# EAGLE design ZS6TVB Arduino AX.25 Interface REV 1.0 (EAGLE 6.4)
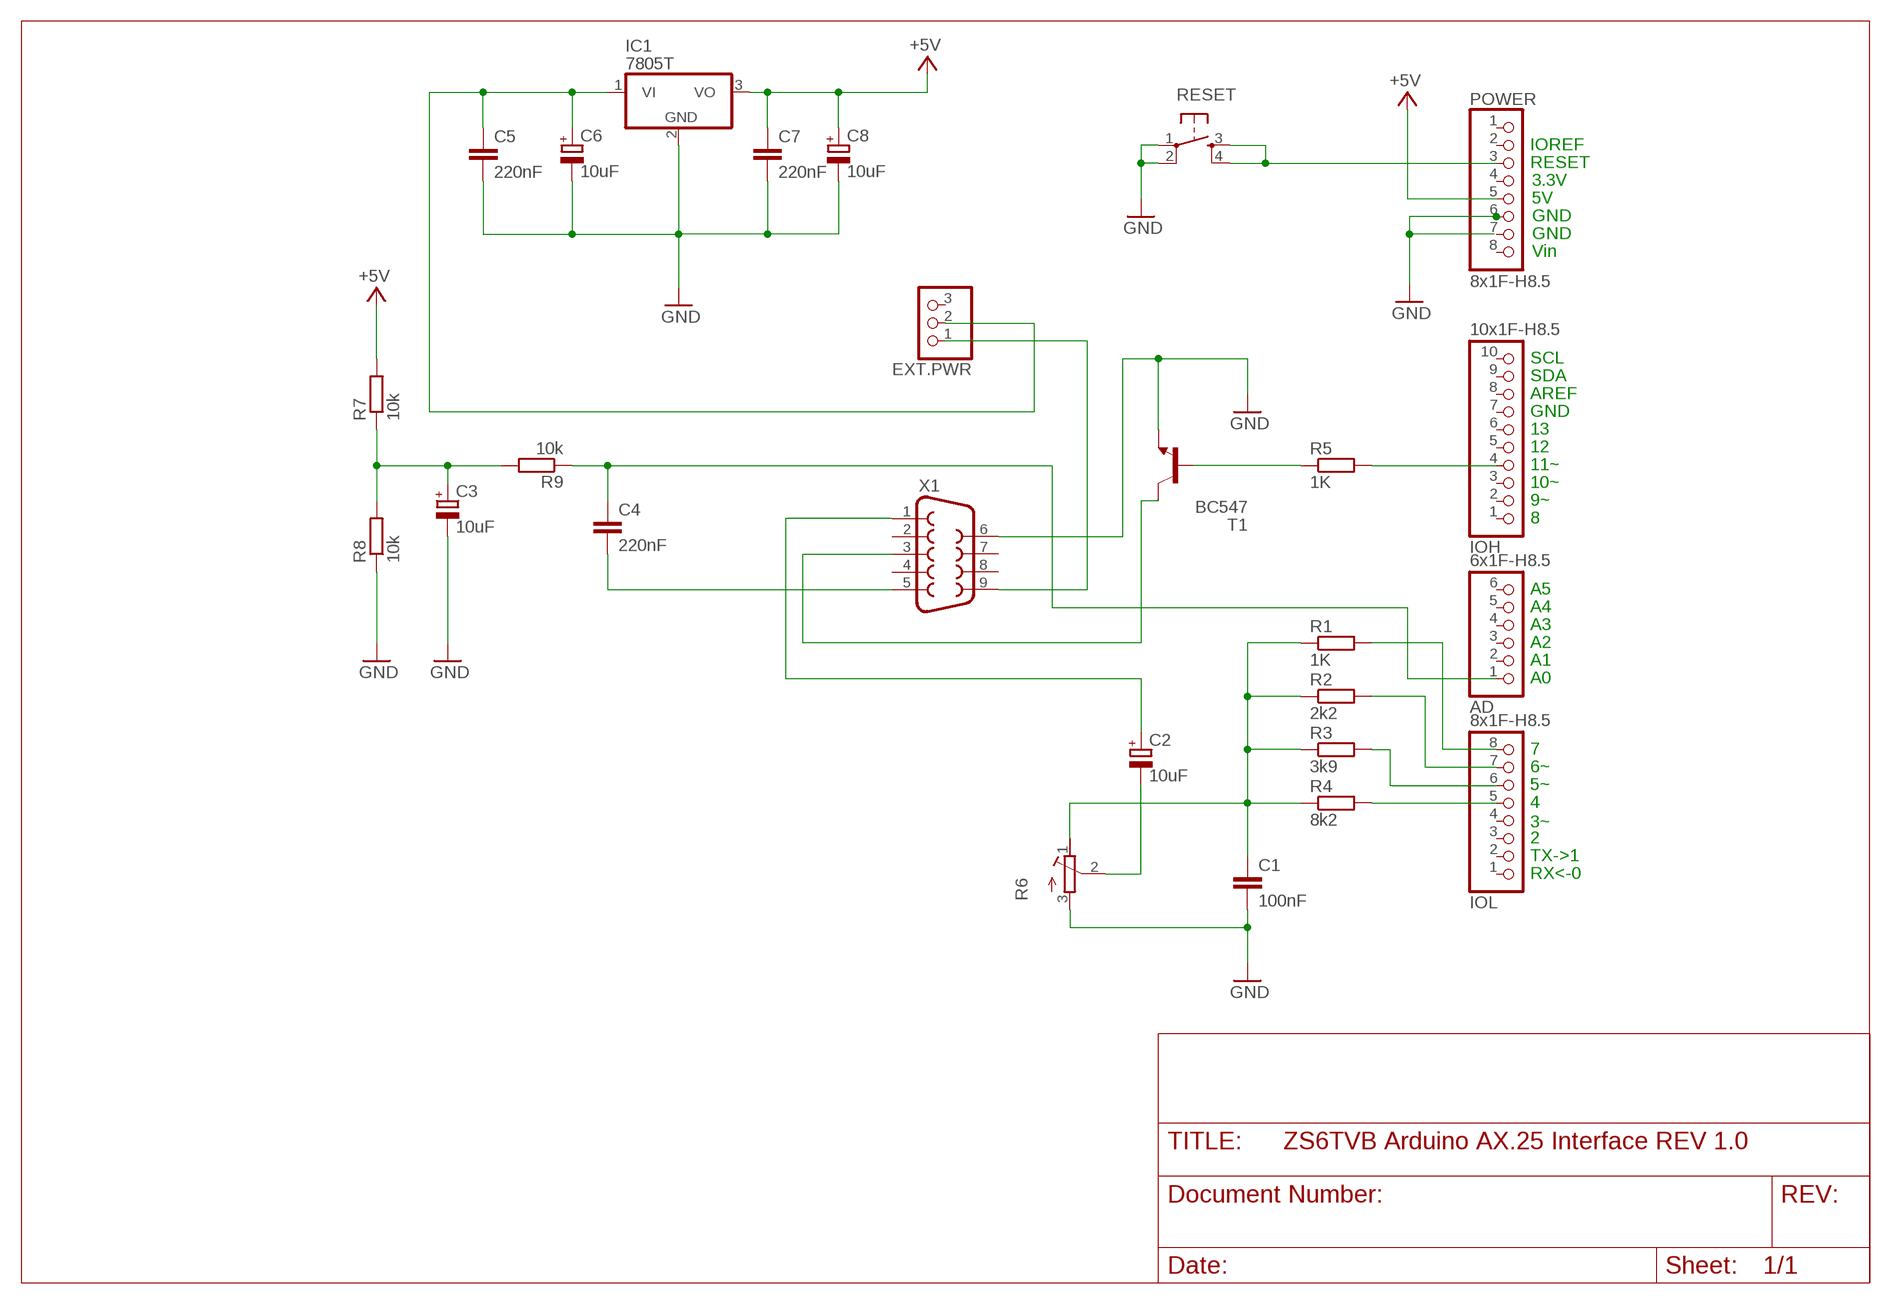
[diagram p0: schematic, sheet 1]

## Parts
AD  6x1F-H8.5  PINHD-1X6  [1X06]
C1  100nF  C-EU050-024X044  [C050-024X044]
C2  10uF  CPOL-EUE5-10.5  [E5-10,5]
C3  10uF  CPOL-EUE5-10.5  [E5-10,5]
C4  220nF  C-EU050-024X044  [C050-024X044]
C5  220nF  C-EU050-024X044  [C050-024X044]
C6  10uF  CPOL-EUE5-10.5  [E5-10,5]
C7  220nF  C-EU050-024X044  [C050-024X044]
C8  10uF  CPOL-EUE5-10.5  [E5-10,5]
EXT.PWR  PINHD-1X3  [1X03]
IC1  7805T  [TO220H]
IOH  10x1F-H8.5  PINHD-1X10_ARD  [1X10]
IOL  8x1F-H8.5  PINHD-1X8  [1X08]
POWER  8x1F-H8.5  PINHD-1X8  [1X08]
R1  1K  R-EU_0207/7  [0207/7]
R2  2k2  R-EU_0207/7  [0207/7]
R3  3k9  R-EU_0207/7  [0207/7]
R4  8k2  R-EU_0207/7  [0207/7]
R5  1K  R-EU_0207/7  [0207/7]
R6  R-TRIMMT93XB  [RTRIMT93XB]
R7  10k  R-EU_0207/7  [0207/7]
R8  10k  R-EU_0207/7  [0207/7]
R9  10k  R-EU_0207/7  [0207/7]
RESET  TAC_SWITCHPTH  [TACTILE-PTH]
T1  BC547  [TO92]
X1  F09HP  [F09HP]

## Nets
+5V: C7.1 C8.+ IC1.3(VO) POWER.5 R7.2
GND: C1.2 C3.- C5.2 C6.- C7.2 C8.- IC1.2(GND) POWER.6 R6.3(A) R8.1 RESET.1 RESET.2 T1.1(E) X1.6
N$1: POWER.3 RESET.3 RESET.4
N$2: IOL.8 R1.2
N$3: IOL.7 R2.2
N$4: IOL.5 R4.2
N$5: EXT.PWR.1 X1.9
N$6: C2.+ X1.1
N$7: IOL.6 R3.2
N$8: C1.1 R1.1 R2.1 R3.1 R4.1 R6.1(E)
N$9: C2.- R6.2(S)
N$10: IOH.4 R5.2
N$11: R5.1 T1.2(B)
N$12: T1.3(C) X1.3
N$13: C4.2 X1.5
N$14: C3.+ R7.1 R8.2 R9.2
N$15: AD.1 C4.1 R9.1
N$16: C5.1 C6.+ EXT.PWR.2 IC1.1(VI)
Unconnected: AD.2 AD.3 AD.4 AD.5 AD.6 EXT.PWR.3 IOH.1 IOH.2 IOH.3 IOH.5 IOH.6 IOH.7 IOH.8 IOH.9 IOH.10 IOL.1 IOL.2 IOL.3 IOL.4 POWER.1 POWER.2 POWER.4 POWER.7 POWER.8 X1.2 X1.4 X1.7 X1.8

## Notes on the sheet
- IOREF
- RESET
- 3.3V
- 5V
- GND
- GND
- Vin
- SCL
- SDA
- AREF
- GND
- 13
- 12
- 11~
- 10~
- 9~
- 8
- A5
- A4
- A3
- A2
- A1
- A0
- 7
- 6~
- 5~
- 4
- 3~
- 2
- TX->1
- RX<-0

## Library data of the parts
AD = SmartPrj:PINHD-1X6: PIN HEADER
C1 C4 C5 C7 = rcl:C-EU: CAPACITOR, European symbol
C2 C3 C6 C8 = rcl:CPOL-EU: POLARIZED CAPACITOR, European symbol
EXT.PWR = adafruit:PINHD-1X3: PIN HEADER
IC1 = adafruit:78*: Positive VOLTAGE REGULATOR Added bigger pads to the TO-92 package
IOH = SmartPrj:PINHD-1X10_ARD: PIN HEADER
IOL POWER = SmartPrj:PINHD-1X8: PIN HEADER
R1-R5 R7-R9 = rcl:R-EU_: RESISTOR, European symbol
R6 = rcl:R-TRIMM: Trimm resistor
RESET = SparkFun-Electromechanical:TAC_SWITCH: Momentary Switch Button commonly used for reset or general input. Spark Fun Electronics SKU : COM-00097 SMT- SWCH-08247
T1 = transistor:BC547: NPN TRANSISTOR
X1 = con-subd:F09: SUB-D; OC_FARNELL: unknown; OC_NEWARK: unknown

## Net classes
0 default: width 0.254 mm, clearance 0.254 mm
1 power: width 0.61 mm, drill 0.61 mm, clearance 0.254 mm
2 gnd: width 0.305 mm, drill 0.559 mm, clearance 0.254 mm
3 usbvcc: width 0.508 mm, drill 0.61 mm, clearance 0.254 mm
4 aref: width 0.406 mm, drill 0.61 mm, clearance 0.254 mm

## Board
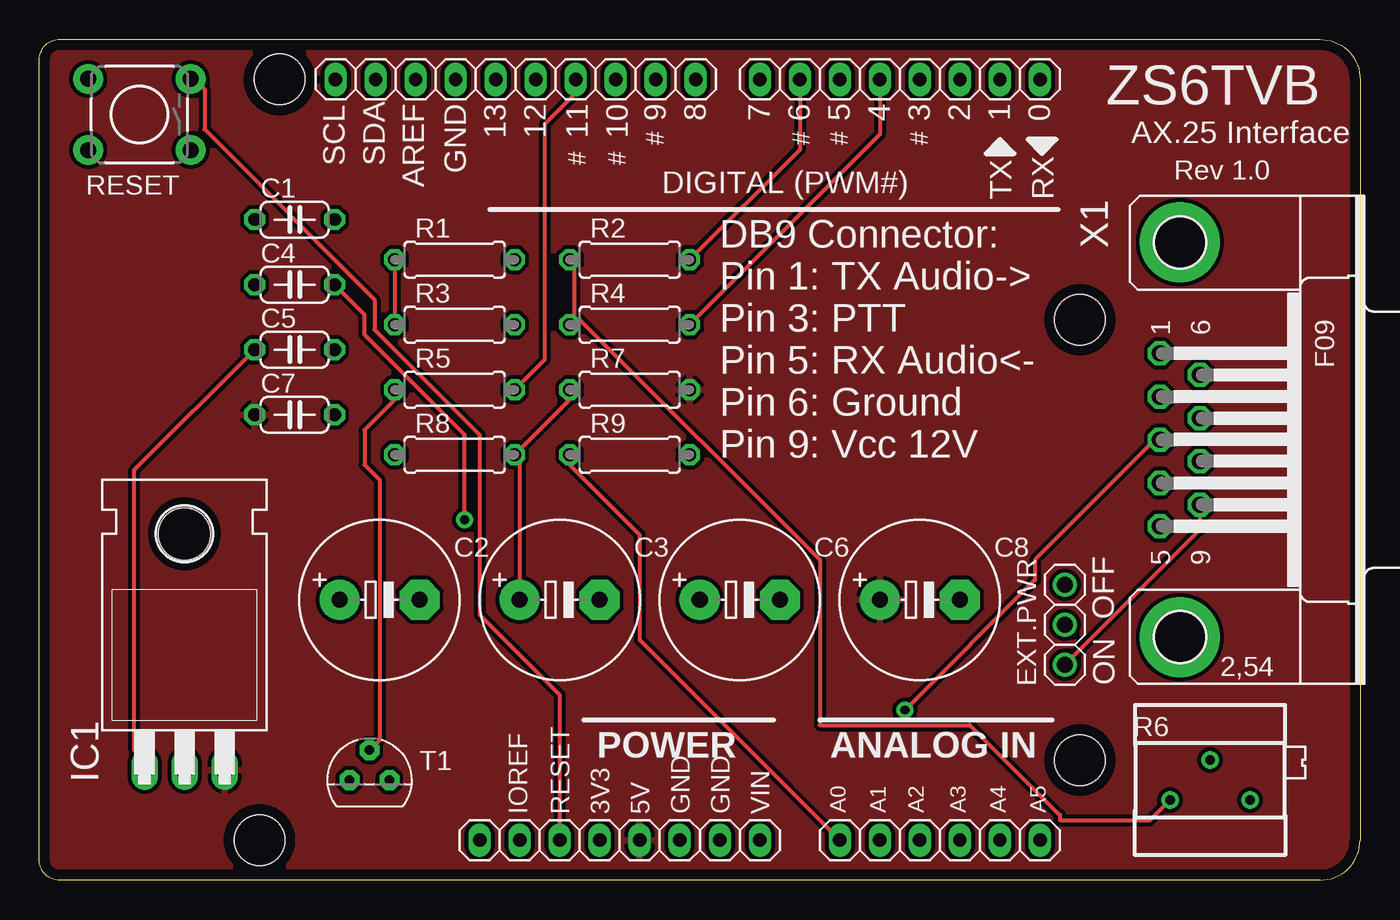
[diagram p1: board, top side]
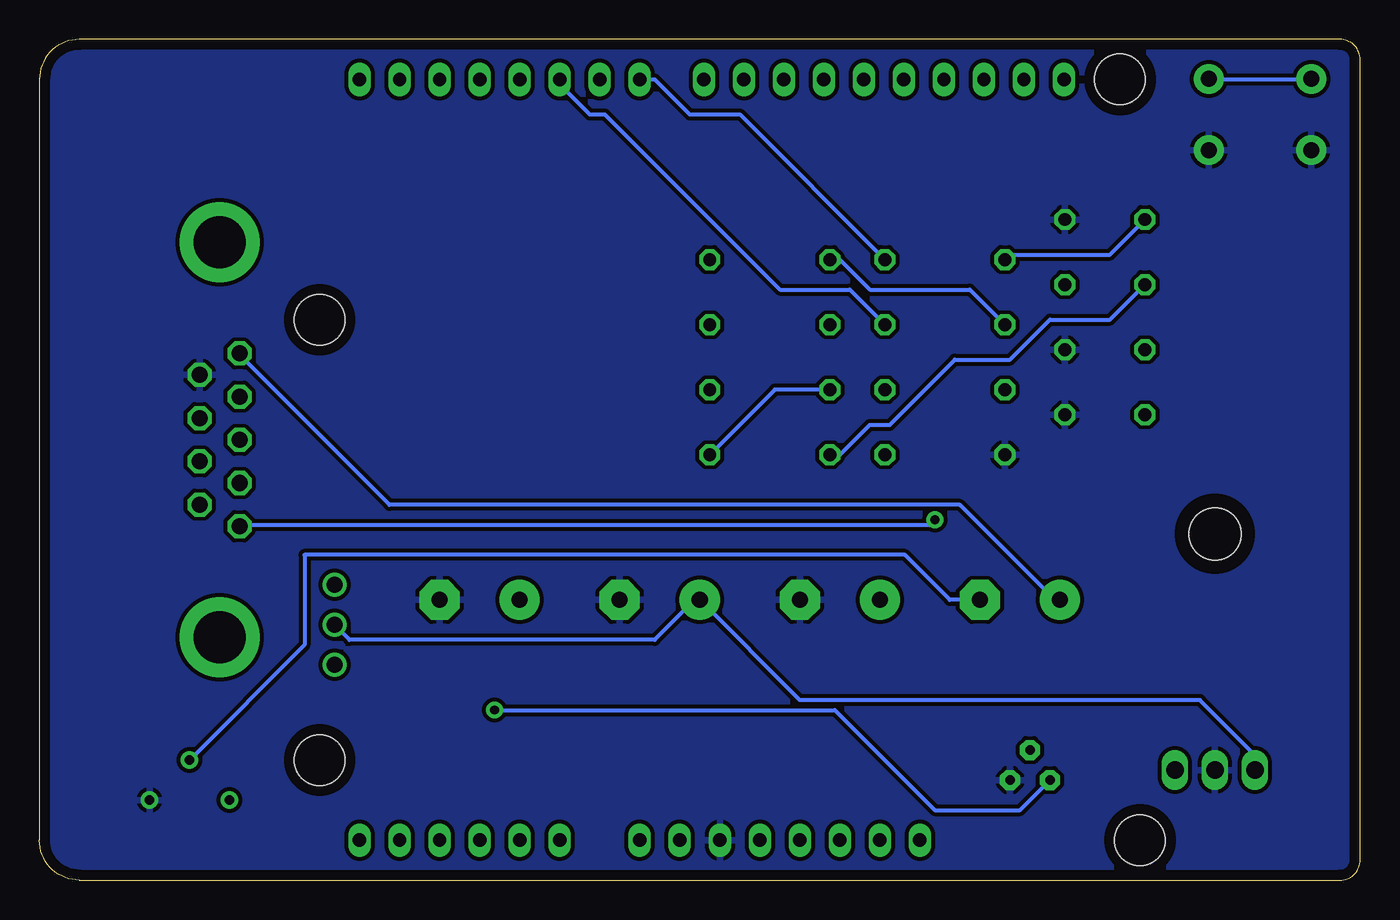
[diagram p2: board, bottom side, seen from below]

Size 83.82 x 53.34 mm. Coordinates in mm from the lower left corner, seen from the top.
Outline: 83.82,50.8 83.82,2.54 arc-90 81.28,0 1.27,0 arc-90 0,1.27 0,52.07 arc-90 1.27,53.34 81.28,53.34 arc-90 83.82,50.8
Copper layers (1*16): Top 0.035mm / dielectric 1.5mm / Bottom 0.035mm
Design rules "default": minimum track width 10mil, minimum drill 22mil, track to track 10mil, track to pad 10mil, pad to pad 10mil, via to via 12mil, smd to smd 8mil, copper to edge 26mil, drill to drill 12mil, minimum pad ring 10mil, minimum via ring 10mil, stop-mask expansion 1mil, vias tented up to drill 30mil, thermal gap 10mil
Holes 3.2 mm at 66.04,35.56 66.04,7.62 15.24,50.8 13.97,2.54

### Footprints (pad centres in the part's own frame; a part is rotated, then mirrored left to right if it is on the bottom)
1X06 = drill 0.85 pad 1.422 long: 1 -6.35,0; 2 -3.81,0; 3 -1.27,0; 4 1.27,0; 5 3.81,0; 6 6.35,0
C050-024X044 = drill 0.813 octagon: 1 -2.54,0; 2 2.54,0
E5-10,5 = drill 1.016 pad 2.54: + -2.54,0 | drill 1.016 pad 2.54 octagon: - 2.54,0
1X03 = drill 1.016: 1 -2.54,0; 2 0,0; 3 2.54,0
TO220H = drill 1.118 long: 1 -2.54,-10.16; 2 0,-10.16; 3 2.54,-10.16 | hole 3.302: 0,4.826
1X10@1 = drill 0.85 pad 1.422 long: 1 -11.43,0; 2 -8.89,0; 3 -6.35,0; 4 -3.81,0; 5 -1.27,0; 6 1.27,0; 7 3.81,0; 8 6.35,0; 9 8.89,0; 10 11.43,0
1X08 = drill 0.85 pad 1.422 long: 1 -8.89,0; 2 -6.35,0; 3 -3.81,0; 4 -1.27,0; 5 1.27,0; 6 3.81,0; 7 6.35,0; 8 8.89,0
0207/7 = drill 0.813 octagon: 1 -3.81,0; 2 3.81,0
RTRIMT93XB = drill 0.61: 1 1.27,-2.54; 2 -1.27,0; 3 1.27,2.54
TACTILE-PTH = drill 1.016 pad 1.88: 1 -3.251,2.261; 2 3.251,2.261; 3 -3.251,-2.261; 4 3.251,-2.261
TO92 = drill 0.6 pad 1.27 octagon: 1 1.27,0; 2 0,1.905; 3 -1.27,0
F09HP = drill 1.016 octagon: 1 -5.486,-1.27; 2 -2.743,-1.27; 3 0,-1.27; 4 2.743,-1.27; 5 5.486,-1.27; 6 -4.115,1.27; 7 -1.372,1.27; 8 1.372,1.27; 9 4.115,1.27 | drill 3.302 pad 5.08: G1 -12.522,0; G2 12.522,0

### Placement (x,y rotation side)
AD  57.15,2.54 0 top
C1  16.19,41.91 0 top
C2  21.59,17.78 0 top
C3  33.02,17.78 0 top
C4  16.19,37.78 0 top
C5  16.19,33.66 0 top
C6  44.45,17.78 0 top
C7  16.19,29.53 0 top
C8  55.88,17.78 0 top
EXT.PWR  65.09,16.19 90 top
IC1  9.21,17.14 0 top
IOH  10x1F-H8.5  [1X10@1]  30.23,50.8 180 top
IOL  54.61,50.8 180 top
POWER  36.83,2.54 0 top
R1  26.35,39.37 0 top
R2  37.47,39.37 0 top
R3  26.35,35.24 0 top
R4  37.47,35.24 0 top
R5  26.35,31.11 0 top
R6  74.3,6.35 270 top
R7  37.47,31.11 0 top
R8  26.35,26.99 0 top
R9  37.47,26.99 0 top
RESET  6.35,48.58 180 top
T1  20.95,6.35 0 top
X1  72.39,27.94 270 top

### Tracks (layer width: path | path; a pad name or v marks a point on that pad's centre or on a via)
+5V
  pour Top: 0,53.34 83.82,53.34 83.82,0 0,0
GND
  pour Bottom: 0,53.34 83.82,53.34 83.82,0 0,0
N$1
  Top 0.254: POWER.3 33.02,11.75 27.94,16.83 27.94,28.26 21.27,34.92 21.27,36.83 10.48,47.62 10.48,50.16 9.84,50.8 RESET.3
  Bottom 0.254: RESET.4 3.17,50.8 9.53,50.8 RESET.3
N$2
  Bottom 0.254: R1.2 39.37,48.58 42.55,48.58 44.77,50.8 IOL.8
N$3
  Top 0.254: R2.2 48.26,46.35 IOL.7
N$4
  Top 0.254: R4.2 53.34,47.31 IOL.5
N$5
  Top 0.254: EXT.PWR.1 73.66,22.23 X1.9
N$6
  Bottom 0.254: C2.+ 19.37,17.78 25.4,23.81 61.59,23.81 71.12,33.34 X1.1
N$7
  Bottom 0.254: R3.2 32.38,37.47 36.83,37.47 47.94,48.58 48.9,48.58 50.8,50.48 IOL.6
N$8
  Top 0.254: R1.1 R3.1 | R6.1 70.48,3.81 64.77,3.81 64.77,4.13 59.05,9.84 49.53,9.84 49.53,20.32 34.29,35.56 33.97,35.56 | 33.97,35.56 33.66,35.56 R4.1 33.97,35.56 | R2.1 33.97,39.05 33.97,35.56
  Bottom 0.254: C1.1 15.88,39.69 22.23,39.69 R1.1 | R3.1 24.77,37.47 31.11,37.47 33.02,39.37 R2.1
N$9
  Bottom 0.254: R6.2 66.99,14.92 66.99,20.64 28.89,20.64 26.04,17.78 C2.-
N$10
  Top 0.254: R5.2 32.07,33.02 32.07,47.94 33.97,49.85 33.97,50.8 IOH.4
N$11
  Top 0.254: T1.2 21.59,8.89 21.59,25.4 20.64,26.35 20.64,28.57 22.54,30.48 R5.1
N$12  (via drill 0.56)
  Top 0.254: v54.93,10.79 63.18,19.05 63.18,20.32 70.8,27.94 X1.3
  Bottom 0.254: T1.3 21.59,4.45 26.99,4.45 33.34,10.79 v54.93,10.79
N$13  (via drill 0.56)
  Top 0.254: C4.2 20.64,35.88 20.64,34.61 26.99,28.26 v26.99,22.86
  Bottom 0.254: v26.99,22.86 27.3,22.54 71.12,22.54 X1.5
N$14
  Top 0.254: 30.48,27.3 33.66,30.48 R7.1 | 30.48,27.3 C3.+ | 30.48,27.3 R8.2
  Bottom 0.254: R9.2 37.15,31.11 R7.1
N$15
  Top 0.254: AD.1 38.1,15.24 38.1,21.91 33.66,26.35 R9.1
  Bottom 0.254: C4.1 15.88,35.56 19.68,35.56 22.23,33.02 25.72,33.02 29.84,28.89 31.11,28.89 33.02,26.99 R9.1
N$16
  Top 0.254: C5.1 6.03,26.04 6.03,8.26 6.67,7.62 IC1.1
  Bottom 0.254: EXT.PWR.2 64.14,15.24 44.77,15.24 42.23,17.78 C6.+ 35.56,11.43 10.16,11.43 6.67,7.94 IC1.1

### Text on the board
tPlace: DB9 Connector: / Pin 1: TX Audio-> / Pin 3: PTT / Pin 5: RX Audio<- / Pin 6: Ground / Pin 9: Vcc 12V | OFF | ON
tNames: ZS6TVB | AREF | GND | 13 | 12 | 11 | 10 | 9 | 8 | 7 | 6 | 5 | 4 | 3 | 2 | 1 | 0 | AX.25 Interface | # | # | # | # | Rev 1.0 | SCL | SDA | # | # | DIGITAL (PWM#) | TX | RX | POWER | ANALOG IN | IOREF | RESET | 3V3 | 5V | GND | GND | VIN | A0 | A1 | A2 | A3 | A4 | A5
214bmp: D:/SmartProjects/Snc/a4_bn_logo2.bmp